# EAGLE design Piezo_array (EAGLE 9.6.1)
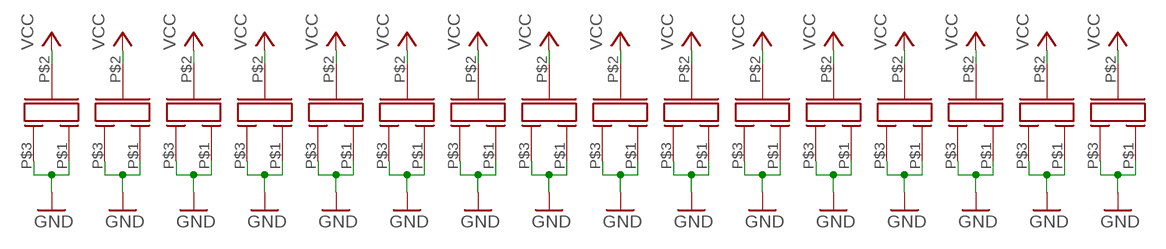
[diagram p0: schematic, sheet 1]

## Parts
U$2  PIEZO  [PIEZO]
U$3  PIEZO  [PIEZO]
U$4  PIEZO  [PIEZO]
U$5  PIEZO  [PIEZO]
U$6  PIEZO  [PIEZO]
U$7  PIEZO  [PIEZO]
U$8  PIEZO  [PIEZO]
U$17  PIEZO  [PIEZO]
U$18  PIEZO  [PIEZO]
U$19  PIEZO  [PIEZO]
U$20  PIEZO  [PIEZO]
U$21  PIEZO  [PIEZO]
U$22  PIEZO  [PIEZO]
U$23  PIEZO  [PIEZO]
U$24  PIEZO  [PIEZO]
U$25  PIEZO  [PIEZO]

## Nets
GND: U$2.P$1 U$2.P$3 U$3.P$1 U$3.P$3 U$4.P$1 U$4.P$3 U$5.P$1 U$5.P$3 U$6.P$1 U$6.P$3 U$7.P$1 U$7.P$3 U$8.P$1 U$8.P$3 U$17.P$1 U$17.P$3 U$18.P$1 U$18.P$3 U$19.P$1 U$19.P$3 U$20.P$1 U$20.P$3 U$21.P$1 U$21.P$3 U$22.P$1 U$22.P$3 U$23.P$1 U$23.P$3 U$24.P$1 U$24.P$3 U$25.P$1 U$25.P$3
VCC: U$2.P$2 U$3.P$2 U$4.P$2 U$5.P$2 U$6.P$2 U$7.P$2 U$8.P$2 U$17.P$2 U$18.P$2 U$19.P$2 U$20.P$2 U$21.P$2 U$22.P$2 U$23.P$2 U$24.P$2 U$25.P$2

## Library data of the parts
U$2-U$8 U$17-U$25 = piezo:PIEZO

## Board
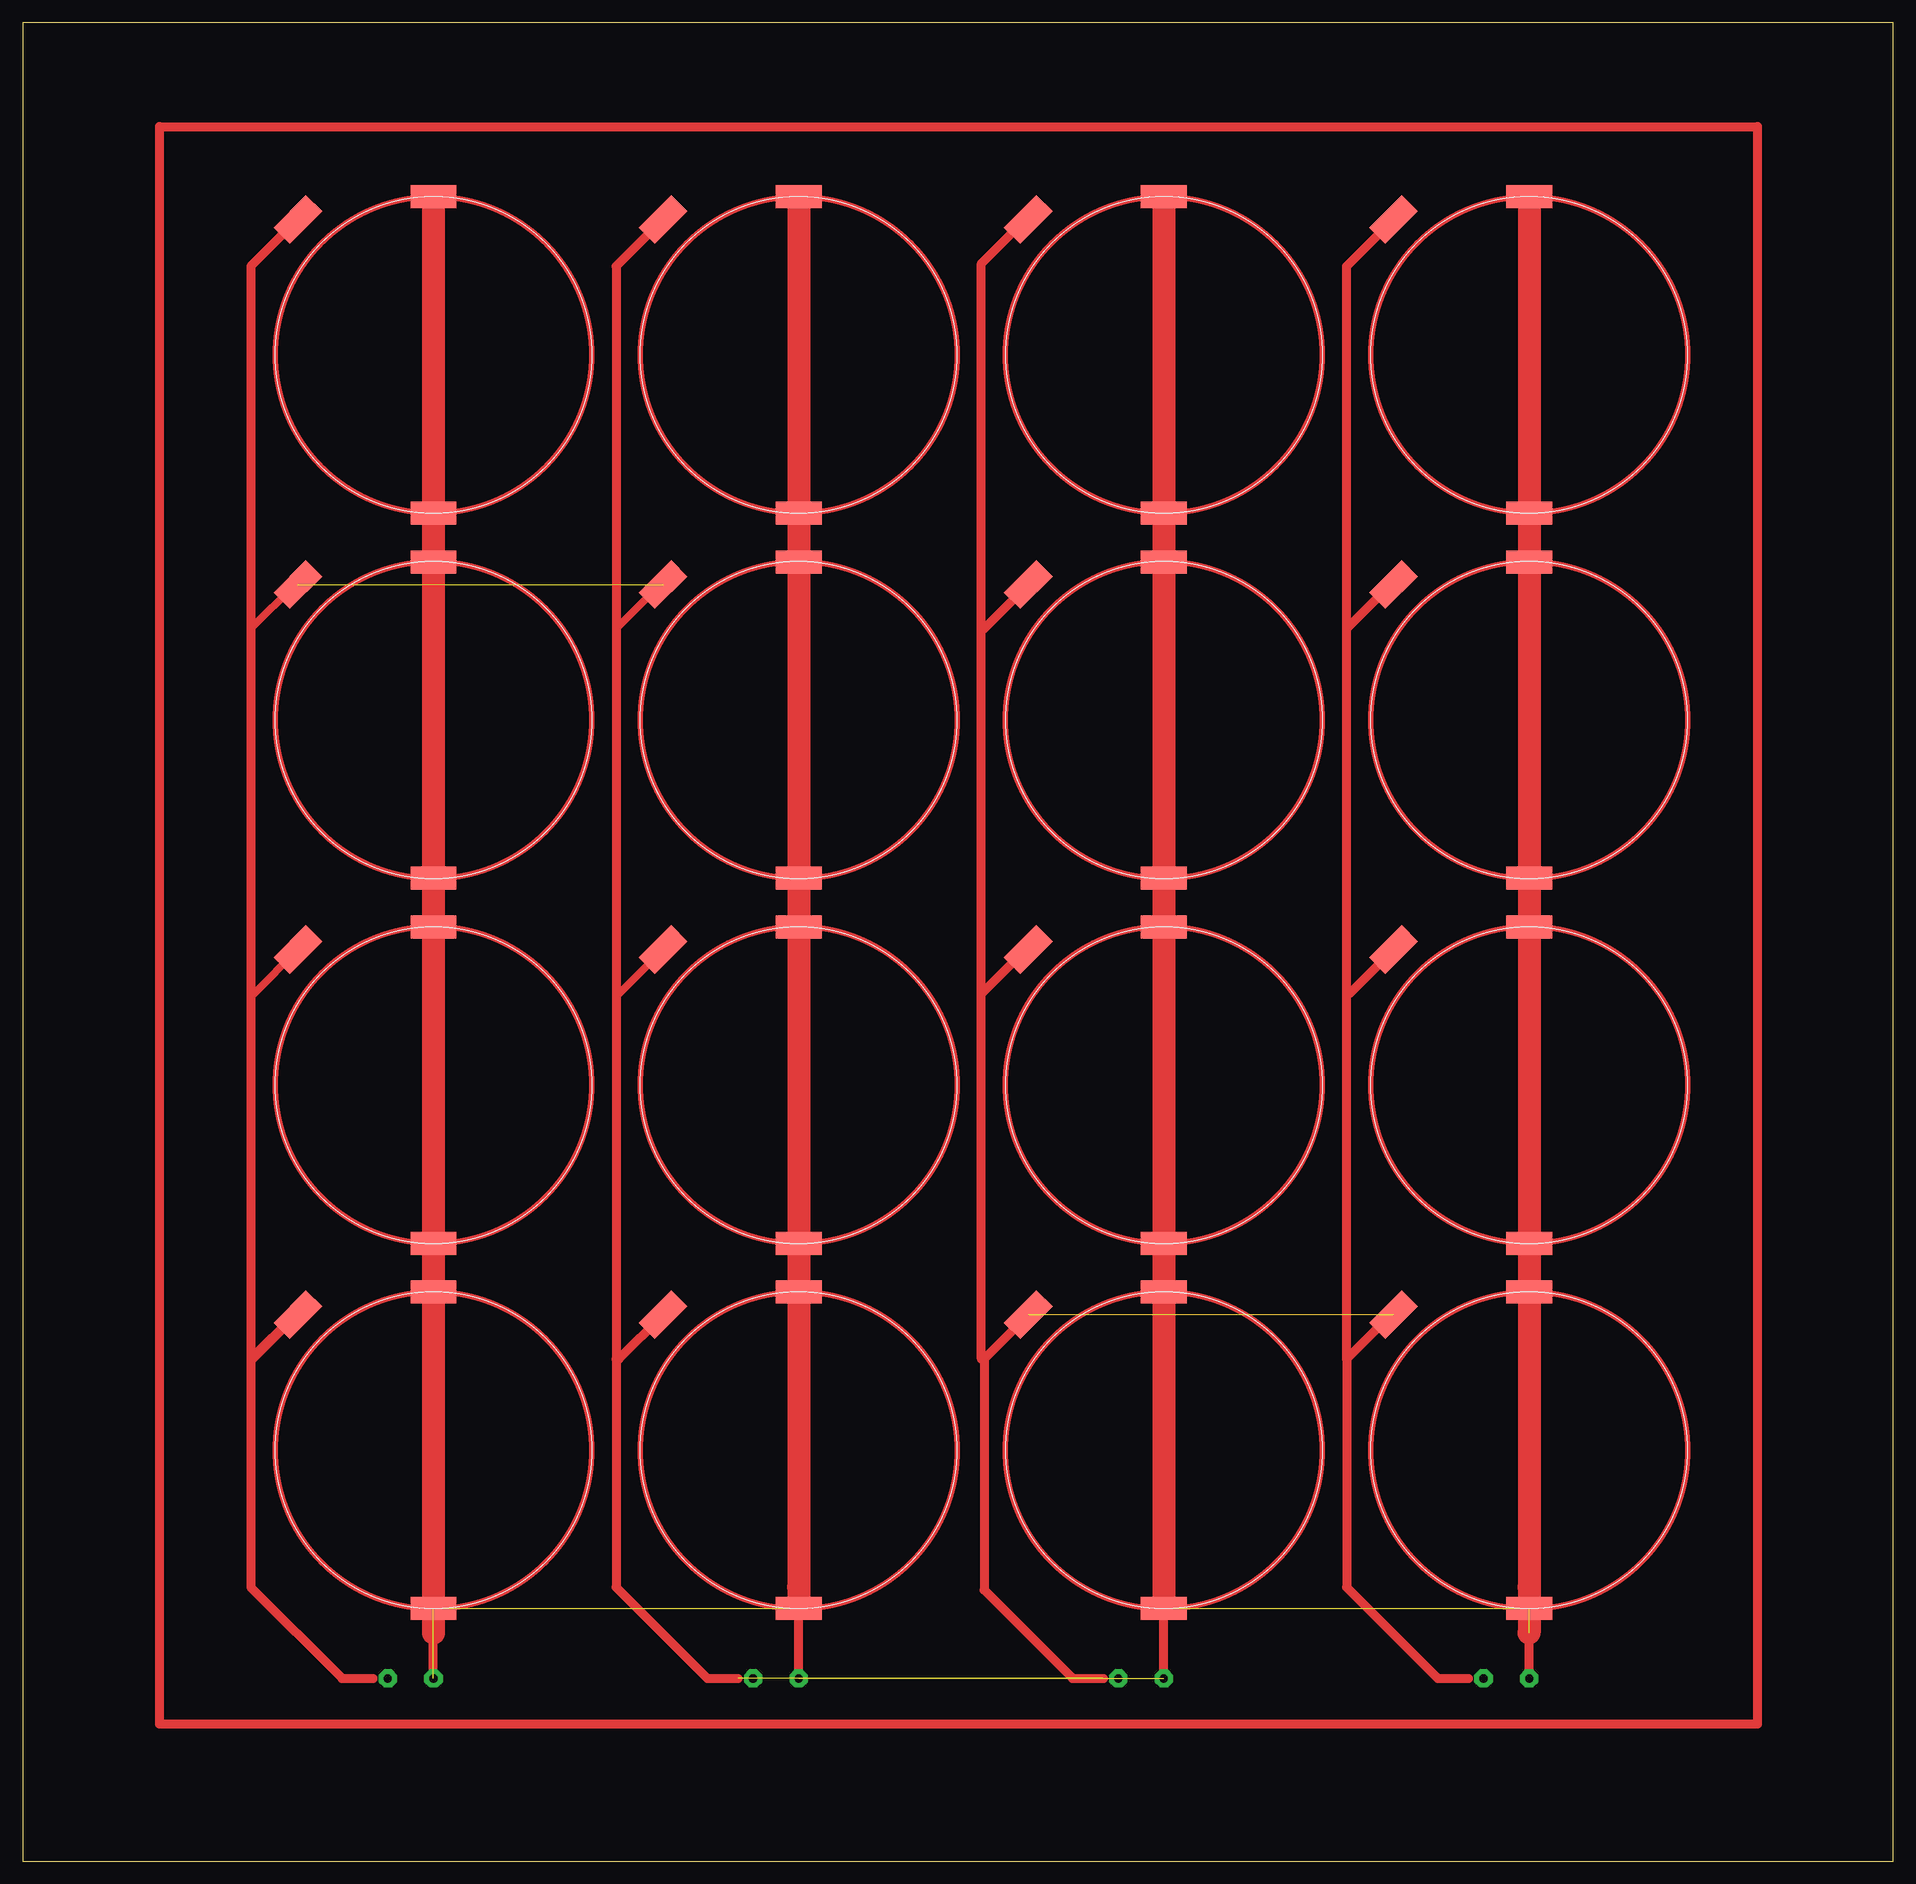
[diagram p1: board, top side]

Size 206.94 x 203.42 mm. Coordinates in mm from the lower left corner, seen from the top.
Outline: 0,0 206.94,0 206.94,203.42 0,203.42 0,0
Copper layers (1*16): Top 0.035mm / dielectric 1.5mm / Bottom 0.035mm
Design rules "default": minimum track width 6mil, minimum drill 0.35mm, track to track 6mil, track to pad 6mil, pad to pad 6mil, via to via 6mil, smd to smd 6mil, copper to edge 40mil, drill to drill 6mil, minimum pad ring 10mil, minimum via ring 8mil, stop-mask expansion 4mil, vias tented up to drill 0mil, thermal gap 10mil

### Footprints (pad centres in the part's own frame; a part is rotated, then mirrored left to right if it is on the bottom)
PIEZO = smd 5.08 x 2.54: P$1 0,17.5; P$3 0,-17.5 | smd 5.08 x 2.54 rotated 45: P$2 -15,15

### Placement (x,y rotation side)
U$2  45.45,166.65 0 top
U$3  85.85,166.65 0 top
U$4  126.25,166.65 0 top
U$5  45.45,126.25 0 top
U$6  85.85,126.25 0 top
U$7  126.25,126.25 0 top
U$8  45.45,85.85 0 top
U$17  85.85,85.85 0 top
U$18  126.25,85.85 0 top
U$19  45.45,45.45 0 top
U$20  85.85,45.45 0 top
U$21  126.25,45.45 0 top
U$22  166.65,126.25 0 top
U$23  166.65,85.85 0 top
U$24  166.65,45.45 0 top
U$25  166.65,166.65 0 top

### Tracks (layer width: path | path; a pad name or v marks a point on that pad's centre or on a via)
GND  (via drill 0.9 pad 2)  (5 unrouted)
  Top 1.016: v45.45,20.2 45.45,25.25 | v85.85,20.2 85.85,30.3 | v126.25,20.2 126.25,30.3 | v166.65,20.2 166.65,30.3
  Top 2.54: U$2.P$1 U$2.P$3 U$5.P$1 U$5.P$3 U$8.P$1 U$8.P$3 U$19.P$1 45.45,25.25 | U$20.P$3 85.85,30.3 U$20.P$1 U$17.P$3 U$17.P$1 U$6.P$3 U$6.P$1 U$3.P$3 U$3.P$1 | U$4.P$1 U$4.P$3 U$7.P$1 U$7.P$3 U$18.P$1 U$18.P$3 U$21.P$1 126.25,30.3 U$21.P$3 | U$25.P$1 U$25.P$3 U$22.P$1 U$22.P$3 U$23.P$1 U$23.P$3 U$24.P$1 166.65,30.3 166.65,25.25
N$1  (via drill 0.9 pad 2)
  other vias: 40.4,20.2
N$2
  Top 1.016: 15.15,191.9 191.9,191.9 191.9,15.15 15.15,15.15 15.15,191.9
N$3  (via drill 0.9 pad 2)
  other vias: 80.8,20.2
N$6  (via drill 0.9 pad 2)
  other vias: 121.2,20.2
N$8  (via drill 0.9 pad 2)
  other vias: 161.6,20.2
VCC  (3 unrouted)
  Top 0.813: 65.65,176.45 65.65,136.35 | 65.65,136.35 65.65,95.95 | 65.65,95.95 65.65,55.55 65.95,55.55 | U$6.P$2 70.55,141.25 65.65,136.35 | U$17.P$2 65.95,95.95 65.65,95.95 | 25.25,176.45 25.25,136.35 | 25.25,136.35 25.25,95.95 | 25.25,95.95 25.25,55.55 25.55,55.55 U$19.P$2 | U$5.P$2 30.15,141.25 25.25,136.35 | U$8.P$2 25.55,95.95 25.25,95.95
  Top 1.016: U$3.P$2 65.65,176.45 65.65,55.55 65.65,30.3 75.75,20.2 79.14,20.2 | 65.95,55.55 U$20.P$2 | U$2.P$2 25.25,176.45 25.25,55.55 | 25.25,55.55 30.15,60.45 U$19.P$2 | U$4.P$2 110.95,181.65 106.05,176.75 106.05,136.35 | 106.05,95.95 106.05,55.55 106.35,55.55 | 106.05,95.95 106.05,136.35 | U$21.P$2 106.35,55.55 | U$25.P$2 146.45,176.45 146.45,136.35 | 146.45,55.55 146.45,95.95 | 146.45,95.95 146.45,136.35 | U$24.P$2 151.35,60.45 146.45,55.55 | U$23.P$2 146.75,95.95 146.45,95.95 | U$22.P$2 151.35,141.25 146.45,136.35 | U$7.P$2 106.35,136.35 106.05,136.35 | U$18.P$2 110.95,100.85 106.05,95.95 | 25.25,55.55 25.25,30.3 35.35,20.2 38.74,20.2 | 106.35,55.55 106.35,30 116.15,20.2 119.54,20.2 | 146.45,55.55 146.45,30.3 156.55,20.2 159.94,20.2
(copper drawn outside any net)
  shapes: Top circle x16